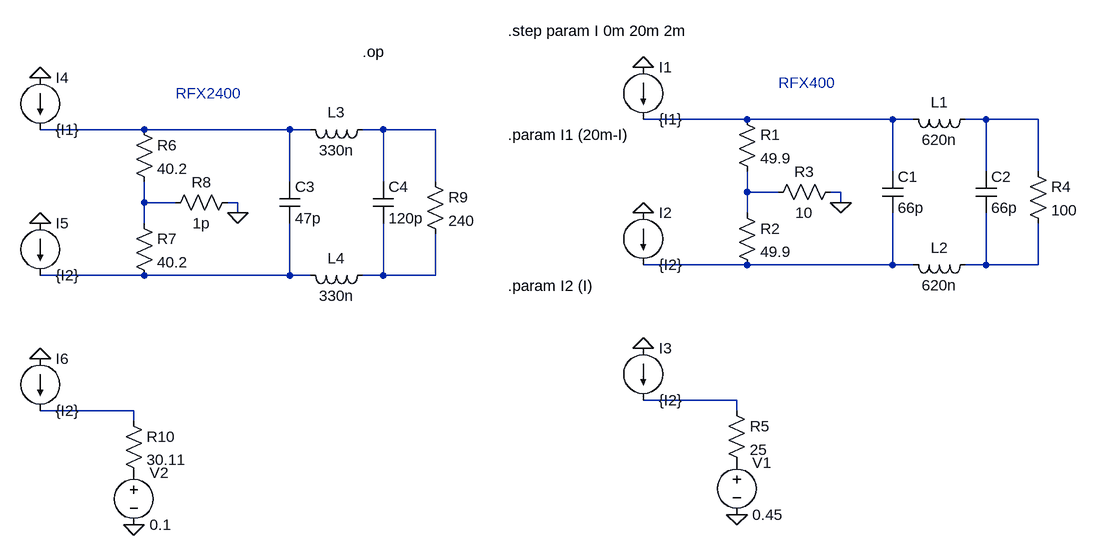
[diagram p0: schematic RFX.asc]
RFX.asc, the LTspice schematic file:
Version 4
SHEET 1 880 760
WIRE 144 112 -16 112
WIRE 368 112 144 112
WIRE 400 112 368 112
WIRE 512 112 480 112
WIRE 592 112 512 112
WIRE -784 128 -944 128
WIRE -560 128 -784 128
WIRE -528 128 -560 128
WIRE -416 128 -448 128
WIRE -336 128 -416 128
WIRE 368 192 368 112
WIRE 512 192 512 112
WIRE 592 192 592 112
WIRE -560 208 -560 128
WIRE -416 208 -416 128
WIRE -336 208 -336 128
WIRE 144 224 144 192
WIRE 192 224 144 224
WIRE 288 224 272 224
WIRE -784 240 -784 208
WIRE -736 240 -784 240
WIRE -640 240 -656 240
WIRE 288 240 288 224
WIRE -640 256 -640 240
WIRE 144 256 144 224
WIRE -784 272 -784 240
WIRE 144 336 -16 336
WIRE 368 336 368 256
WIRE 368 336 144 336
WIRE 400 336 368 336
WIRE 512 336 512 256
WIRE 512 336 480 336
WIRE 592 336 592 272
WIRE 592 336 512 336
WIRE -784 352 -944 352
WIRE -560 352 -560 272
WIRE -560 352 -784 352
WIRE -528 352 -560 352
WIRE -416 352 -416 272
WIRE -416 352 -448 352
WIRE -336 352 -336 288
WIRE -336 352 -416 352
WIRE 128 544 -16 544
WIRE -800 560 -944 560
WIRE 128 560 128 544
WIRE -800 576 -800 560
FLAG 288 240 0
FLAG -16 32 0
FLAG -16 256 0
FLAG -16 464 0
FLAG 128 720 0
FLAG -640 256 0
FLAG -944 48 0
FLAG -944 272 0
FLAG -944 480 0
FLAG -800 736 0
SYMBOL res 128 96 R0
SYMATTR InstName R1
SYMATTR Value 49.9
SYMBOL res 128 240 R0
SYMATTR InstName R2
SYMATTR Value 49.9
SYMBOL res 176 240 R270
WINDOW 0 32 56 VTop 0
WINDOW 3 0 56 VBottom 0
SYMATTR InstName R3
SYMATTR Value 10
SYMBOL res 576 176 R0
SYMATTR InstName R4
SYMATTR Value 100
SYMBOL cap 352 192 R0
SYMATTR InstName C1
SYMATTR Value 66p
SYMBOL cap 496 192 R0
SYMATTR InstName C2
SYMATTR Value 66p
SYMBOL ind 496 96 R90
WINDOW 0 5 56 VBottom 0
WINDOW 3 32 56 VTop 0
SYMATTR InstName L1
SYMATTR Value 620n
SYMBOL ind 496 320 R90
WINDOW 0 5 56 VBottom 0
WINDOW 3 32 56 VTop 0
SYMATTR InstName L2
SYMATTR Value 620n
SYMBOL current -16 32 R0
SYMATTR InstName I1
SYMATTR Value {I1}
SYMBOL current -16 256 R0
SYMATTR InstName I2
SYMATTR Value {I2}
SYMBOL voltage 128 624 R0
SYMATTR InstName V1
SYMATTR Value 0.45
SYMBOL res 112 544 R0
SYMATTR InstName R5
SYMATTR Value 25
SYMBOL current -16 464 R0
SYMATTR InstName I3
SYMATTR Value {I2}
SYMBOL res -800 112 R0
SYMATTR InstName R6
SYMATTR Value 40.2
SYMBOL res -800 256 R0
SYMATTR InstName R7
SYMATTR Value 40.2
SYMBOL res -752 256 R270
WINDOW 0 32 56 VTop 0
WINDOW 3 0 56 VBottom 0
SYMATTR InstName R8
SYMATTR Value 1p
SYMBOL res -352 192 R0
SYMATTR InstName R9
SYMATTR Value 240
SYMBOL cap -576 208 R0
SYMATTR InstName C3
SYMATTR Value 47p
SYMBOL cap -432 208 R0
SYMATTR InstName C4
SYMATTR Value 120p
SYMBOL ind -432 112 R90
WINDOW 0 5 56 VBottom 0
WINDOW 3 32 56 VTop 0
SYMATTR InstName L3
SYMATTR Value 330n
SYMBOL ind -432 336 R90
WINDOW 0 5 56 VBottom 0
WINDOW 3 32 56 VTop 0
SYMATTR InstName L4
SYMATTR Value 330n
SYMBOL current -944 48 R0
SYMATTR InstName I4
SYMATTR Value {I1}
SYMBOL current -944 272 R0
SYMATTR InstName I5
SYMATTR Value {I2}
SYMBOL voltage -800 640 R0
SYMATTR InstName V2
SYMATTR Value 0.1
SYMBOL res -816 560 R0
SYMATTR InstName R10
SYMATTR Value 30.11
SYMBOL current -944 480 R0
SYMATTR InstName I6
SYMATTR Value {I2}
TEXT 192 56 Left 0 ;RFX400
TEXT -224 136 Left 0 !.param I1 (20m-I)
TEXT -224 368 Left 0 !.param I2 (I)
TEXT -224 -24 Left 0 !.step param I 0m 20m 2m
TEXT -736 72 Left 0 ;RFX2400
TEXT -448 8 Left 0 !.op

The netlist it stands for:
* RFX.asc
R1 N001 N005 49.9
R2 N005 N007 49.9
R3 N005 0 10
R4 N002 N008 100
C1 N001 N007 66p
C2 N002 N008 66p
L1 N002 N001 620n
L2 N008 N007 620n
I1 0 N001 {I1}
I2 0 N007 {I2}
V1 P001 0 0.45
R5 N011 P001 25
I3 0 N011 {I2}
R6 N003 N006 40.2
R7 N006 N009 40.2
R8 N006 0 1p
R9 N004 N010 240
C3 N003 N009 47p
C4 N004 N010 120p
L3 N004 N003 330n
L4 N010 N009 330n
I4 0 N003 {I1}
I5 0 N009 {I2}
V2 P002 0 0.1
R10 N012 P002 30.11
I6 0 N012 {I2}
* RFX400
.param I1 (20m-I)
.param I2 (I)
.step param I 0m 20m 2m
* RFX2400
.op
.backanno
.end